# Altium schematic sheet LED_Board_LED.SchDoc: LED Board
size B; Date: MM/DD/YYYY; Author: LED Team; Organization: ORGANIZATION; Address1: ADDRESS 1; Address2: ADDRESS 2; Address3: ADDRESS 3; Address4: ADDRESS 4; Revision: -; SheetNumber: 2; SheetTotal: 4; ENG_APP_DATE: --/--/--; DSN_APP_DATE: --/--/--; CHK_APP_DATE: --/--/--
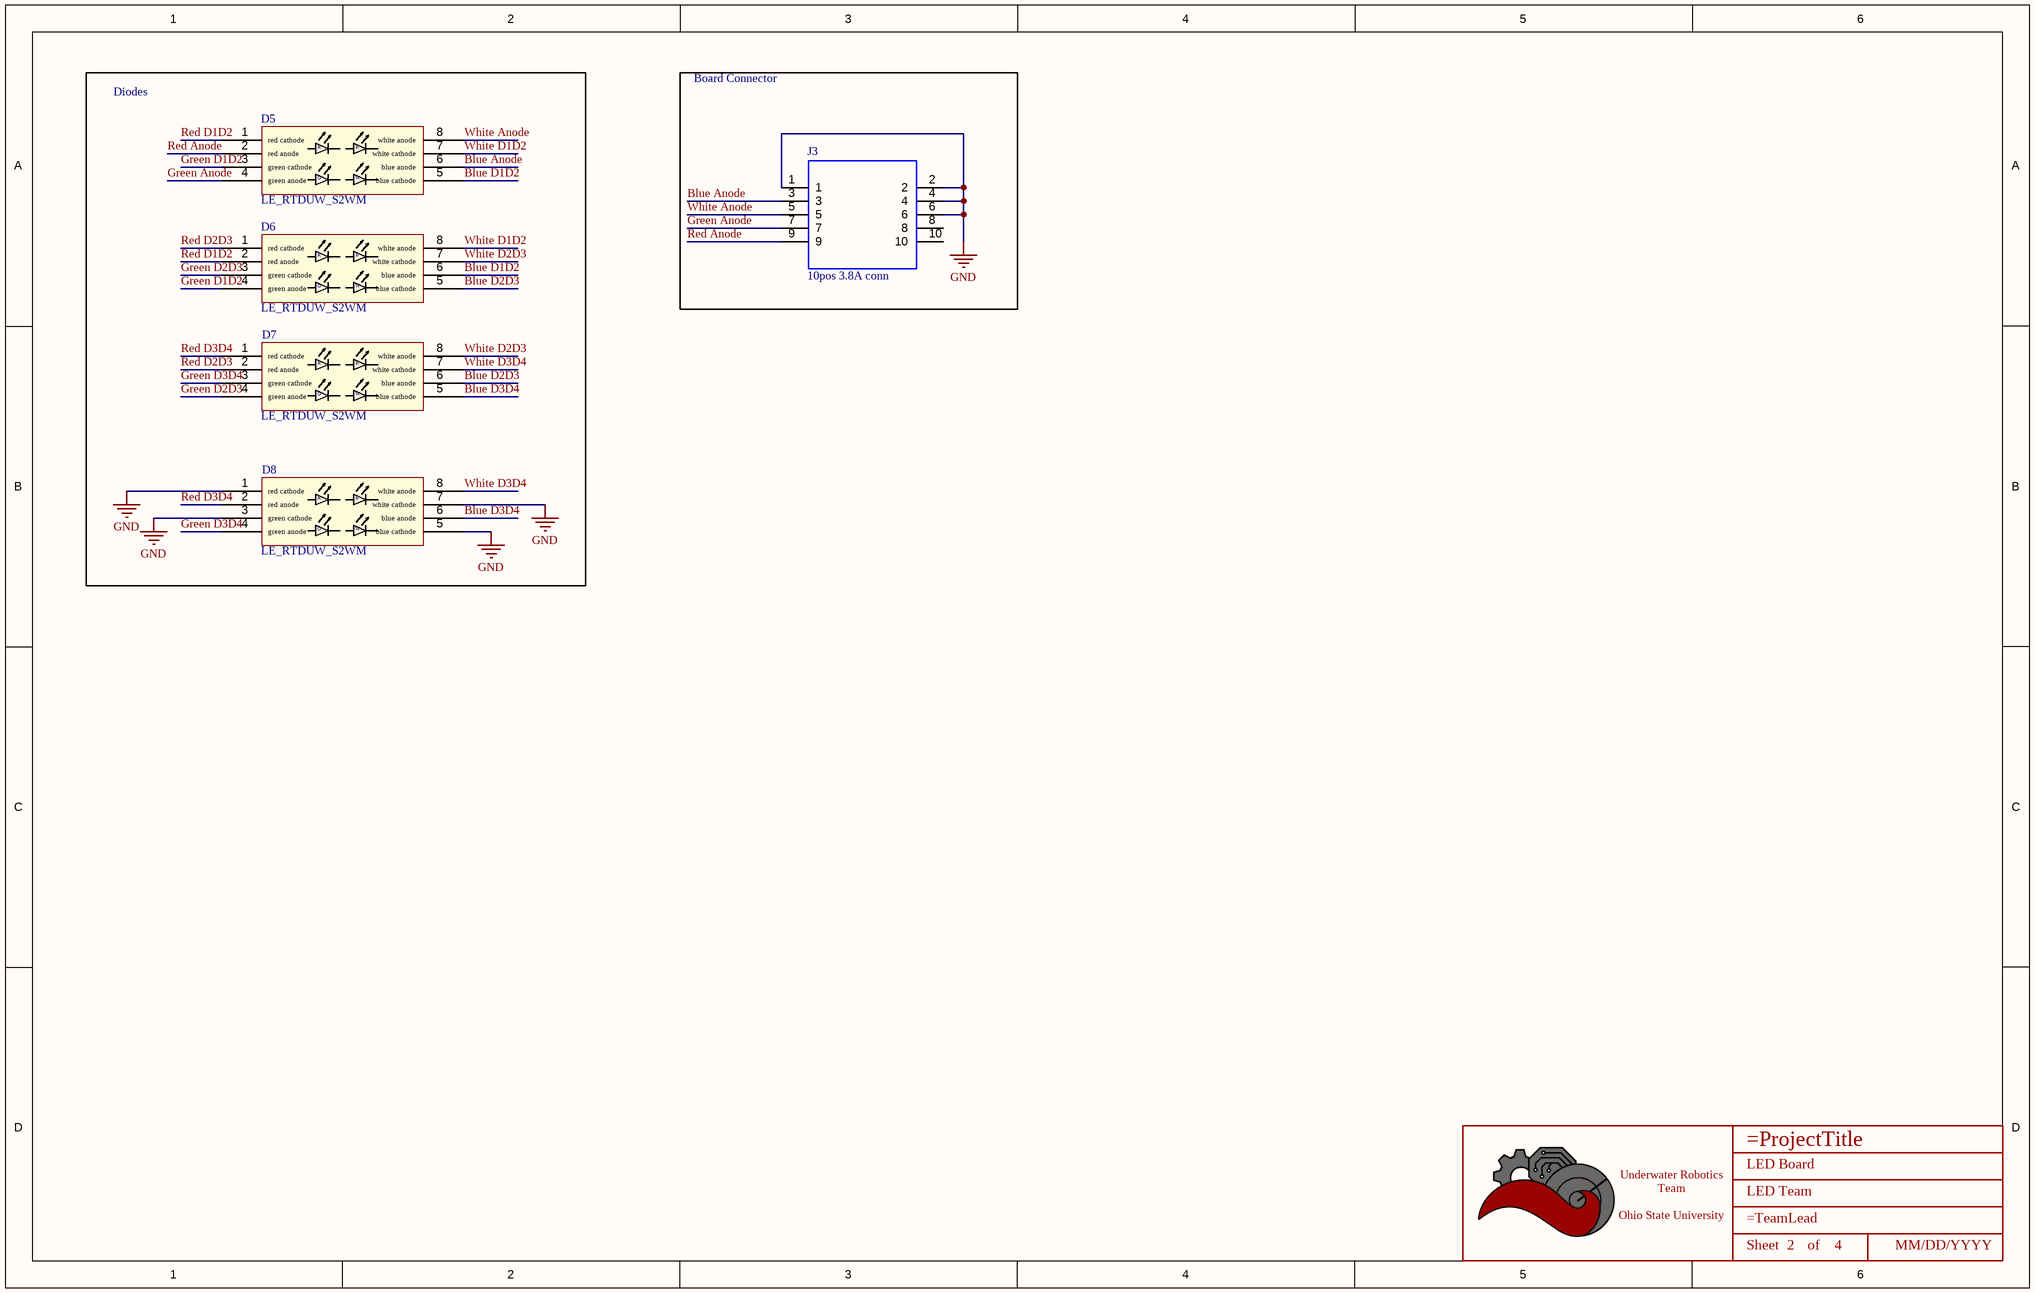
[diagram p0: LED_Board_LED.SchDoc]

## Parts
*  Title_Block  [LOGO]  (value not drawn)  (graphical)
D5  LE_RTDUW_S2WM
D6  LE_RTDUW_S2WM
D7  LE_RTDUW_S2WM
D8  LE_RTDUW_S2WM
J3  10pos 3.8A conn  [SAMTEC-LS2-105-01-X-D-RA2]

## Blocks framed on the sheet
Diodes: D5-D8
Board Connector: J3

## Nets
GND: D8.1(red_cathode) D8.3(green_cathode) D8.5(blue_cathode) D8.7(white_cathode) J3.1 J3.2 J3.4 J3.6
Blue Anode: D5.6(blue_anode) J3.3
Blue D1D2: D5.5(blue_cathode) D6.6(blue_anode)
Blue D2D3: D6.5(blue_cathode) D7.6(blue_anode)
Blue D3D4: D7.5(blue_cathode) D8.6(blue_anode)
Green Anode: D5.4(green_anode) J3.7
Green D1D2: D5.3(green_cathode) D6.4(green_anode)
Green D2D3: D6.3(green_cathode) D7.4(green_anode)
Green D3D4: D7.3(green_cathode) D8.4(green_anode)
Red Anode: D5.2(red_anode) J3.9
Red D1D2: D5.1(red_cathode) D6.2(red_anode)
Red D2D3: D6.1(red_cathode) D7.2(red_anode)
Red D3D4: D7.1(red_cathode) D8.2(red_anode)
White Anode: D5.8(white_anode) J3.5
White D1D2: D5.7(white_cathode) D6.8(white_anode)
White D2D3: D6.7(white_cathode) D7.8(white_anode)
White D3D4: D7.7(white_cathode) D8.8(white_anode)

Not connected (* = marked no-connect by the designer): J3 8 10

## Notes on the sheet
- DWG. NO.
- REV.
- SHT.
- THIS DOCUMENT AND THE DATA DISCLOSED HEREIN OR HEREWITH IS THE PROPERTY OF ALTIUM LIMITED AND MAY BE FREELY DISTRIBUTED IN WHOLE. NO RIGHTS ARE RESERVED OR EXPRESS OR IMPLIED WARANTEE GIVEN.
- REVISION
- DESCRIPTION
- DATE
- APPROVED
- ENG:
- APPROVALS
- PROJECT
- DSN:
- CHK:
- REFERENCE DOCUMENTS
- PROJECT REVISION:
- TITLE
- DOCUMENT REVISION:
- DESIGN ITEM:
- BOM:
- FAB DWG:
- PCB DWG:
- ASSY DWG:
- SCALE:
- SIZE
- B
- CAGE CODE
- FILE NAME
- DWG NO.
- SHEET
- OF
- REV
- (in symbol LE_RTDUW_S2WM) R; B; G; W
- (in symbol Title_Block) Underwater Robotics Team / Ohio State University; Sheet; of

## Library data of the parts
* = Title_Block: UWRT Schematic Title Block Template / Created June 2021, Dylan Trainor
D5-D8 = LE_RTDUW_S2WM: LED OSTAR RGBW 625/527/453NM SMD; Designator: D; Supplier 1: Mouser; Supplier Part Number 1: 720-LERTDUWS2WMA2120
J3 = SAMTEC-LS2-105-01-X-D-RA2: 10 Position Connector Self Mating, Non-Gendered, Hermaphroditic Through Hole, Right Angle Gold; Package: None; Price: None; Value: *; MP: SAMTEC-LS2-105-01-X-D-RA2; Availability: Unavailable; Supplier 1: Mouser; Supplier Part Number 1: 200-LS210501FDRA2